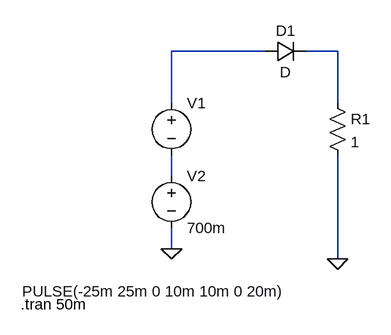
[diagram p0: schematic kleinsignal_diode.asc]
kleinsignal_diode.asc, the LTspice schematic file:
Version 4
SHEET 1 880 680
WIRE 288 -64 144 -64
WIRE 400 -64 352 -64
WIRE 144 16 144 -64
WIRE 400 16 400 -64
WIRE 144 128 144 96
WIRE 144 240 144 208
WIRE 400 256 400 96
FLAG 144 240 0
FLAG 400 256 0
SYMBOL voltage 144 0 R0
WINDOW 3 -230 306 Left 2
WINDOW 123 0 0 Left 2
WINDOW 39 0 0 Left 2
SYMATTR InstName V1
SYMATTR Value PULSE(-25m 25m 0 10m 10m 0 20m)
SYMBOL voltage 144 112 R0
WINDOW 123 0 0 Left 2
WINDOW 39 0 0 Left 2
SYMATTR InstName V2
SYMATTR Value 700m
SYMBOL diode 288 -48 R270
WINDOW 0 32 32 VTop 2
WINDOW 3 0 32 VBottom 2
SYMATTR InstName D1
SYMBOL res 384 0 R0
SYMATTR InstName R1
SYMATTR Value 1
TEXT -88 326 Left 2 !.tran 50m

The netlist it stands for:
* kleinsignal_diode.asc
V1 N001 N003 PULSE(-25m 25m 0 10m 10m 0 20m)
V2 N003 0 700m
D1 N001 N002 D
R1 N002 0 1
.model D D
.lib standard.dio
.tran 50m
.backanno
.end